# Altium schematic sheet main.SchDoc
size A4
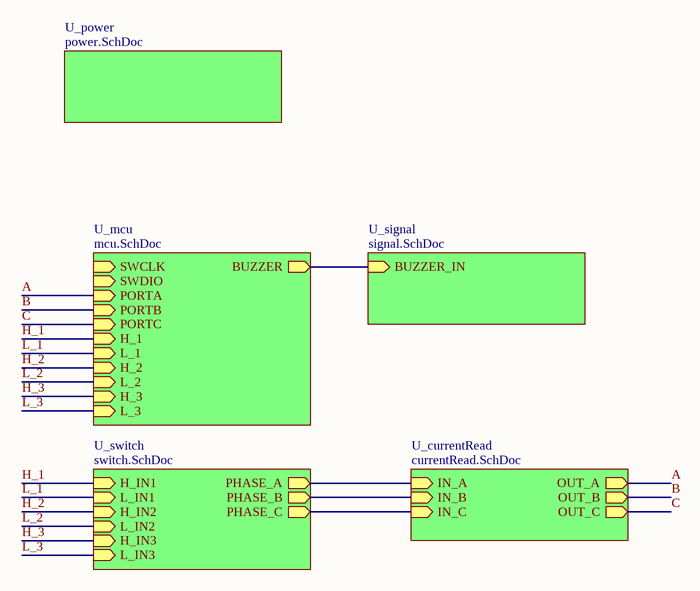
[diagram p0: main.SchDoc]

## Sub-sheets
U_currentRead = currentRead.SchDoc: OUT_A (out), IN_A (in), OUT_B (out), IN_B (in), OUT_C (out), IN_C (in)
U_mcu = mcu.SchDoc: SWCLK (in), SWDIO (in), PORTA (in), PORTB (in), PORTC (in), BUZZER (out), H_1 (in), L_1 (in), H_2 (in), L_2 (in), H_3 (in), L_3 (in)
U_power = power.SchDoc: no entries
U_signal = signal.SchDoc: BUZZER_IN (in)
U_switch = switch.SchDoc: H_IN1 (in), L_IN1 (in), PHASE_A (out), H_IN2 (in), L_IN2 (in), PHASE_B (out), H_IN3 (in), L_IN3 (in), PHASE_C (out)

## Nets
A: sheet U_currentRead/OUT_A, sheet U_mcu/PORTA
B: sheet U_currentRead/OUT_B, sheet U_mcu/PORTB
C: sheet U_currentRead/OUT_C, sheet U_mcu/PORTC
H_1: sheet U_switch/H_IN1, sheet U_mcu/H_1
H_2: sheet U_switch/H_IN2, sheet U_mcu/H_2
H_3: sheet U_switch/H_IN3, sheet U_mcu/H_3
L_1: sheet U_switch/L_IN1, sheet U_mcu/L_1
L_2: sheet U_switch/L_IN2, sheet U_mcu/L_2
L_3: sheet U_switch/L_IN3, sheet U_mcu/L_3
(unnamed): sheet U_currentRead/IN_A, sheet U_switch/PHASE_A
(unnamed): sheet U_currentRead/IN_B, sheet U_switch/PHASE_B
(unnamed): sheet U_currentRead/IN_C, sheet U_switch/PHASE_C
(unnamed): sheet U_signal/BUZZER_IN, sheet U_mcu/BUZZER